# EAGLE schematic Apo Board 2017_Capsense (EAGLE 7.3.0)
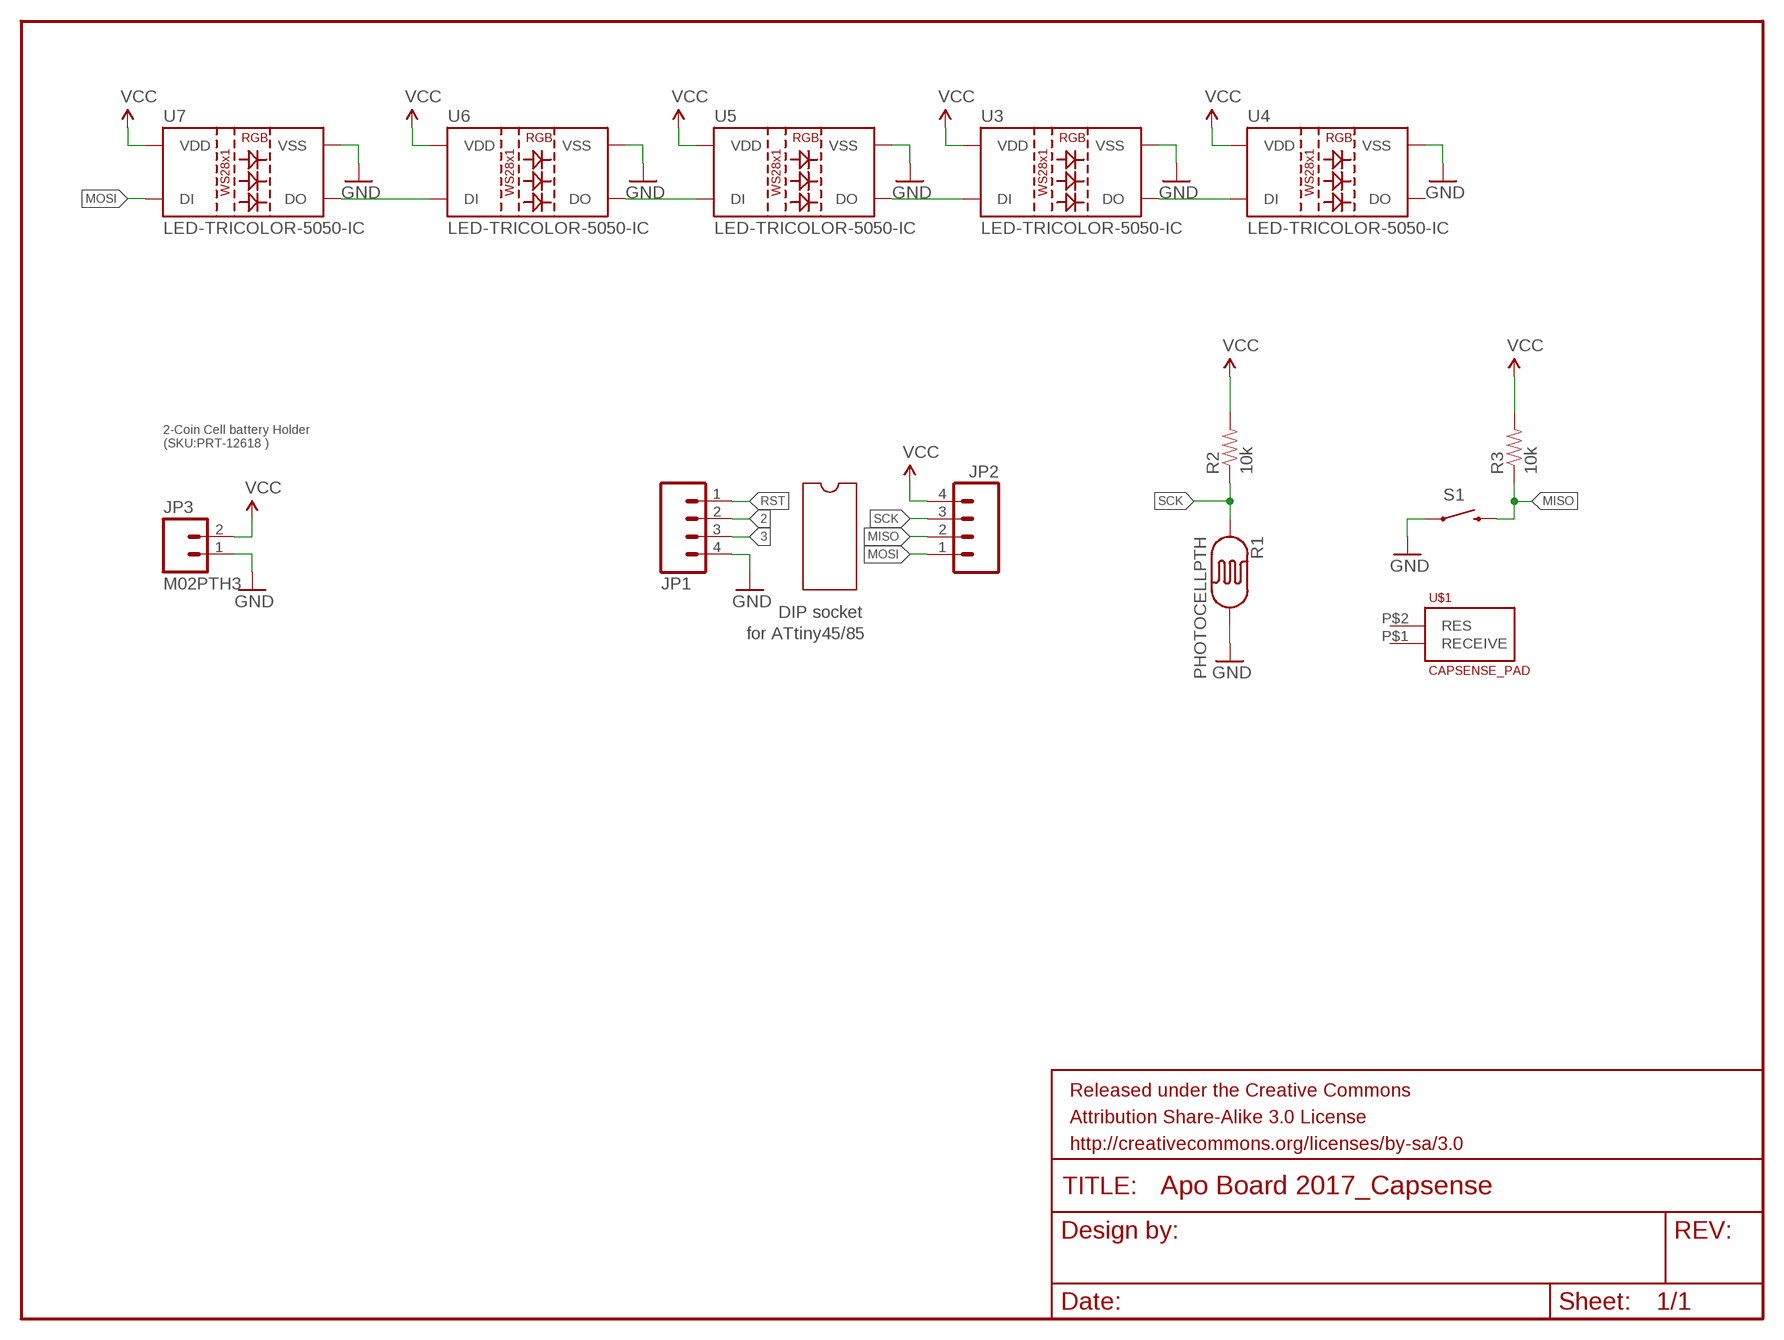
[diagram p0: schematic, sheet 1]

## Parts
FRAME1  FRAME-LETTER  [CREATIVE_COMMONS]
JP1  M04PTH  [1X04]
JP2  M04PTH  [1X04]
JP3  M02PTH3  [1X02_LONGPADS]
R1  PHOTOCELLPTH  [PHOTOCELL]
R2  10k  RESISTORPTH-1/4W  [AXIAL-0.4]
R3  10k  RESISTORPTH-1/4W  [AXIAL-0.4]
S1  SWITCH-MOMENTARY-2PTH  [TACTILE-PTH]
U3  LED-TRICOLOR-5050-IC  [LED-RGB-THRU]
U4  LED-TRICOLOR-5050-IC  [LED-RGB-THRU]
U5  LED-TRICOLOR-5050-IC  [LED-RGB-THRU]
U6  LED-TRICOLOR-5050-IC  [LED-RGB-THRU]
U7  LED-TRICOLOR-5050-IC  [LED-RGB-THRU]
U$1  CAPSENSE_PAD  [CAPSENSE_PAD]

## Nets
2: JP1.2
3: JP1.3
GND: JP1.4 JP3.1 R1.2 S1.1 U3.3(VSS) U4.3(VSS) U5.3(VSS) U6.3(VSS) U7.3(VSS)
MISO: JP2.2 R3.P$1 S1.3
MOSI: JP2.1 U7.1(DI)
N$1: U6.1(DI) U7.4(DO)
N$2: U5.1(DI) U6.4(DO)
N$5: U3.1(DI) U5.4(DO)
N$6: U3.4(DO) U4.1(DI)
RST: JP1.1
SCK: JP2.3 R1.1 R2.P$1
VCC: JP2.4 JP3.2 R2.P$2 R3.P$2 U3.2(VDD) U4.2(VDD) U5.2(VDD) U6.2(VDD) U7.2(VDD)
Unconnected: U4.4(DO) U$1.P$1(RECEIVE) U$1.P$2(RES)

## Notes on the sheet
- 2-Coin Cell battery Holder
  (SKU:PRT-12618 )
- DIP socket
- for ATtiny45/85

## Library data of the parts
FRAME1 = SparkFun-Aesthetics:FRAME-LETTER: Schematic Frame Standard 8.5x11 US Letter frame
JP1 JP2 = SparkFun-Connectors:M04: Header 4 Standard 4-pin 0.1" header. Use with straight break away headers (SKU : PRT-00116), right angle break away headers (PRT-00553), swiss pins (PRT-00743), machine pins (PRT-00117), and female headers (PRT-00115). Molex polarized connector foot print use with SKU : PRT-08231 with associated crimp pins and housings. 1MM SMD Version SKU: PRT-10208
JP3 = SparkFun-Connectors:M02: Standard 2-pin 0.1" header. Use with - straight break away headers ( PRT-00116) - right angle break away headers (PRT-00553) - swiss pins (PRT-00743) - machine pins (PRT-00117) - female headers (PRT-00115) Molex polarized connector foot print use with: PRT-08233 with associated crimp pins and housings. 2.54_SCREWTERM for use with PRT-10571. 3.5mm Screw Terminal footprints for PRT-08084 5mm Screw Terminal footprints for use with PRT-08433
R1 = SparkFun-Sensors:PHOTOCELL: CdS photoresistor. This is a low cost way to detect light levels. Resistance decreases with more incoming light. SparkFun SKU: SEN-09088
R2 R3 = SparkFun-Resistors:RESISTOR: Resistor Basic schematic elements and footprints for 0603, 1206, and PTH resistors.
S1 = SparkFun-Electromechanical:SWITCH-MOMENTARY-2: Various NO switches- pushbuttons, reed, etc
U3-U7 = SparkFun-LED:LED-TRICOLOR-5050-IC: WS2811 RGB LED w/driver 5x5mm SMD LED with built-in controller IC. DIO-11598
U$1 = SparkFun-Electromechanical:CAPSENSE_PAD: Generic copper pad for a capacitive touch sensor.